# EAGLE design Grove - 2 Channel Inductive Sensor（LDC1612) (EAGLE 6.4)
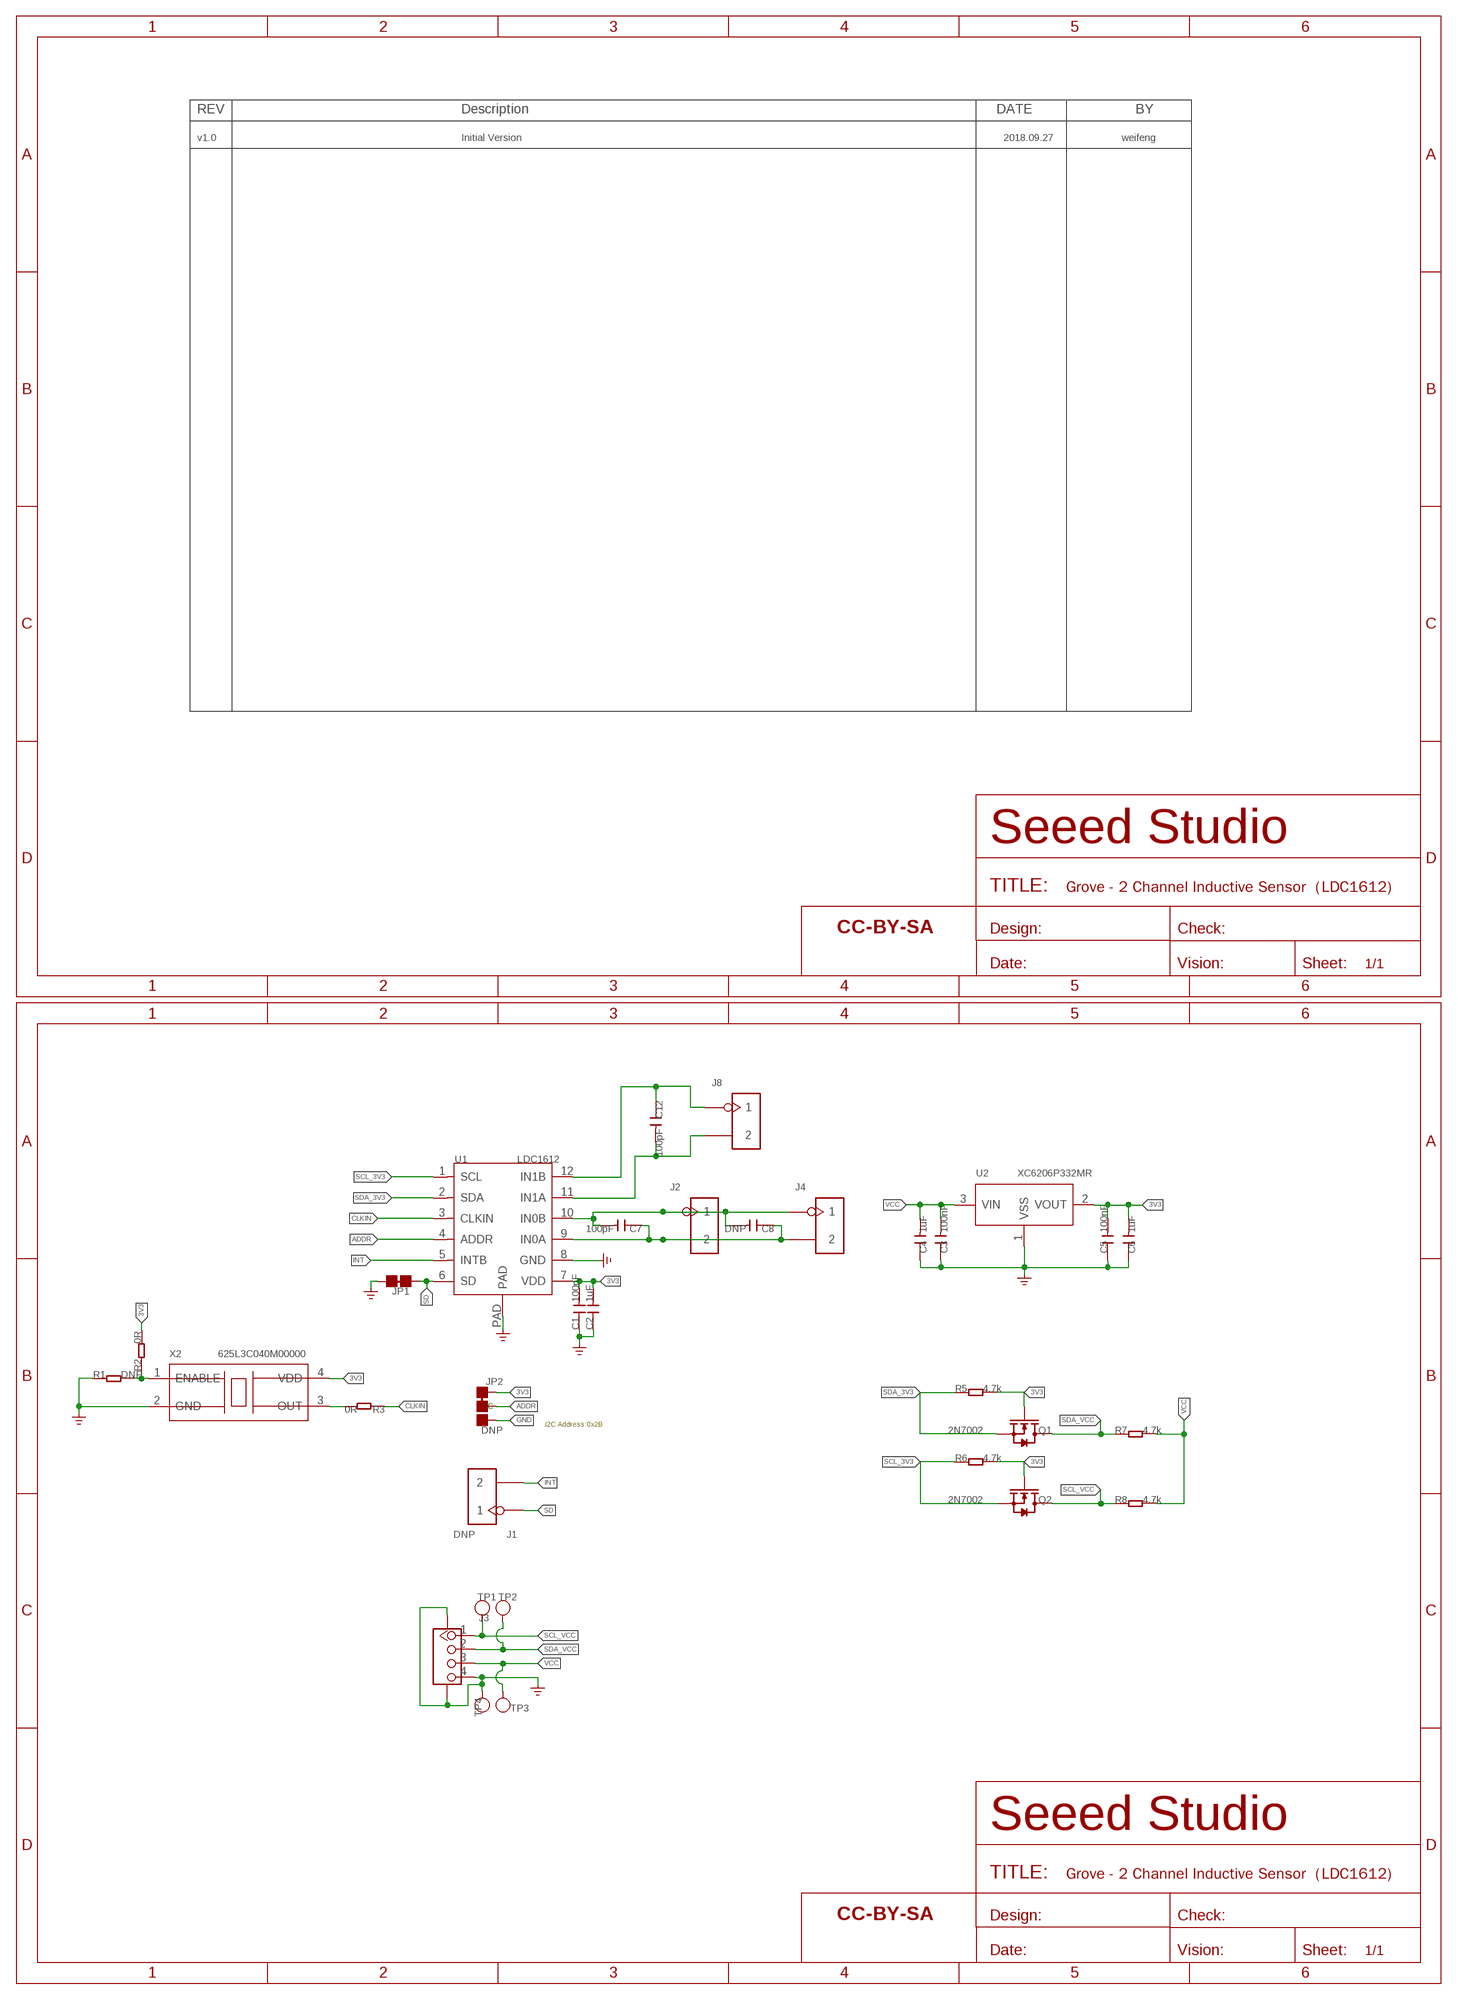
[diagram p0: schematic, sheet 1]

## Parts
C1  100nF  CAP-0603  [C0603]
C2  1uF  CAP-0603  [C0603]
C3  100nF  CAP-0603  [C0603]
C4  1uF  CAP-0603  [C0603]
C5  100nF  CAP-0603  [C0603]
C6  1uF  CAP-0603  [C0603]
C7  100pF  CAP-0603  [C0603]
C8  DNP  CAP-0603  [C0603]
C12  100pF  CAP-0603  [C0603]
FR1  SEEEDSTUDIO-OPEN-SCH-FRAME  [SEEEDSTUDIO-PCB-FRAME]
J1  DNP  HEADER-2P-65/35MIL  [H2-2.54]
J2  HEADER-2P-65/35MIL  [H2-2.54]
J3  GROVE-CONNECTOR-SMD'DD'  [HW4-SMD-2.0]
J4  HEADER-2P-65/35MIL  [H2-2.54]
J8  HEADER-2P-65/35MIL  [H2-2.54]
JP1  JP-2P-SHORT  [2P-SMD-SHORT]
JP2  DNP  JP-3P-SHORT  [3P-SMD-SHORT]
Q1  2N7002  MOSFET-N'SOT23'  [SOT-23]
Q2  2N7002  MOSFET-N'SOT23'  [SOT-23]
R1  DNP  RES-0603  [R0603]
R2  0R  RES-0603  [R0603]
R3  0R  RES-0603  [R0603]
R5  4.7k  RES-0603  [R0603]
R6  4.7k  RES-0603  [R0603]
R7  4.7k  RES-0603  [R0603]
R8  4.7k  RES-0603  [R0603]
TP1  TEST-POINT'4545'  [TP-D45MIL]
TP2  TEST-POINT'4545'  [TP-D45MIL]
TP3  TEST-POINT'4545'  [TP-D45MIL]
TP4  TEST-POINT'4545'  [TP-D45MIL]
U1  LDC1612  DRIVER-LDC1612  [DFN12G-0.5-4X4MM]
U2  XC6206P332MR  PMIC-XC6206PMR  [SOT-23]
U$4  SEEEDSTUDIO-OPEN-SCH-FRAME  [SEEEDSTUDIO-PCB-FRAME]
X2  625L3C040M00000  CRYSTAL-OSCILLATOR-2.5*2.0  [OSC4-SMD-2.5X2.0X0.8MM]

## Nets
3V3: C1.2 C2.2 C5.2 C6.2 JP2.11(L) Q1.1(G) Q2.1(G) R2.2 R5.2 R6.2 U1.7(VDD) U2.2(VOUT) X2.4(VDD)
ADDR: JP2.MM(C) U1.4(ADDR)
CLKIN: R3.1 U1.3(CLKIN)
GND: C1.1 C2.1 C3.1 C4.1 C5.1 C6.1 J3.4 J3.SS1 J3.SS2 JP1.1 JP2.00(R) R1.1 TP4.T U1.8(GND) U1.PAD U2.1(VSS) X2.2(GND) ; supply symbol labelled GND_POWER
INT: J1.2 U1.5(INTB)
N$1: R3.2 X2.3(OUT)
N$3: R1.2 R2.1 X2.1(ENABLE)
N$5: C7.1 C8.1 J2.2 J4.2 U1.9(IN0A)
N$6: C7.2 C8.2 J2.1 J4.1 U1.10(IN0B)
N$14: C12.1 J8.1 U1.12(IN1B)
N$15: C12.2 J8.2 U1.11(IN1A)
SCL_3V3: Q2.2(S) R6.1 U1.1(SCL)
SCL_VCC: J3.1 Q2.3(D) R8.1 TP1.T
SD: J1.1 JP1.2 U1.6(SD)
SDA_3V3: Q1.2(S) R5.1 U1.2(SDA)
SDA_VCC: J3.2 Q1.3(D) R7.1 TP2.T
VCC: C3.2 C4.2 J3.3 R7.2 R8.2 TP3.T U2.3(VIN)

## Notes on the sheet
- v1.0 | Initial Version | 2018.09.27 | weifeng
- I2C Address:0x2B

## Library data of the parts
C1-C8 C12 = Discrete-new:CAP: Ceramic Capacitors
FR1 U$4 = moudle-new:SEEEDSTUDIO-OPEN-SCH-FRAME
J1 J2 J4 J8 = Connector-new:HEADER-2P
J3 = Connector-new:GROVE-CONNECTOR-SMD: 4P-SMD-2.0:320110030;4P-SMD-2.0-90D:320110032
JP1 = Discrete-new:JP-2P-SHORT
JP2 = Discrete-new:JP-3P-SHORT
Q1 Q2 = Discrete-new:MOSFET-N
R1-R3 R5-R8 = Discrete-new:RES
TP1-TP4 = Discrete-new:TEST-POINT; PARTNO: DNP
U1 = IC-new:DRIVER-LDC1612
U2 = IC-new:PMIC-XC6206P: LOW ESR Cap.Compatible Positive Voltage Regulators
X2 = Discrete-new:CRYSTAL-OSCILLATOR

## Net classes
3 usbvcc: width 0.203 mm, drill 0.305 mm, clearance 0.203 mm

## Board
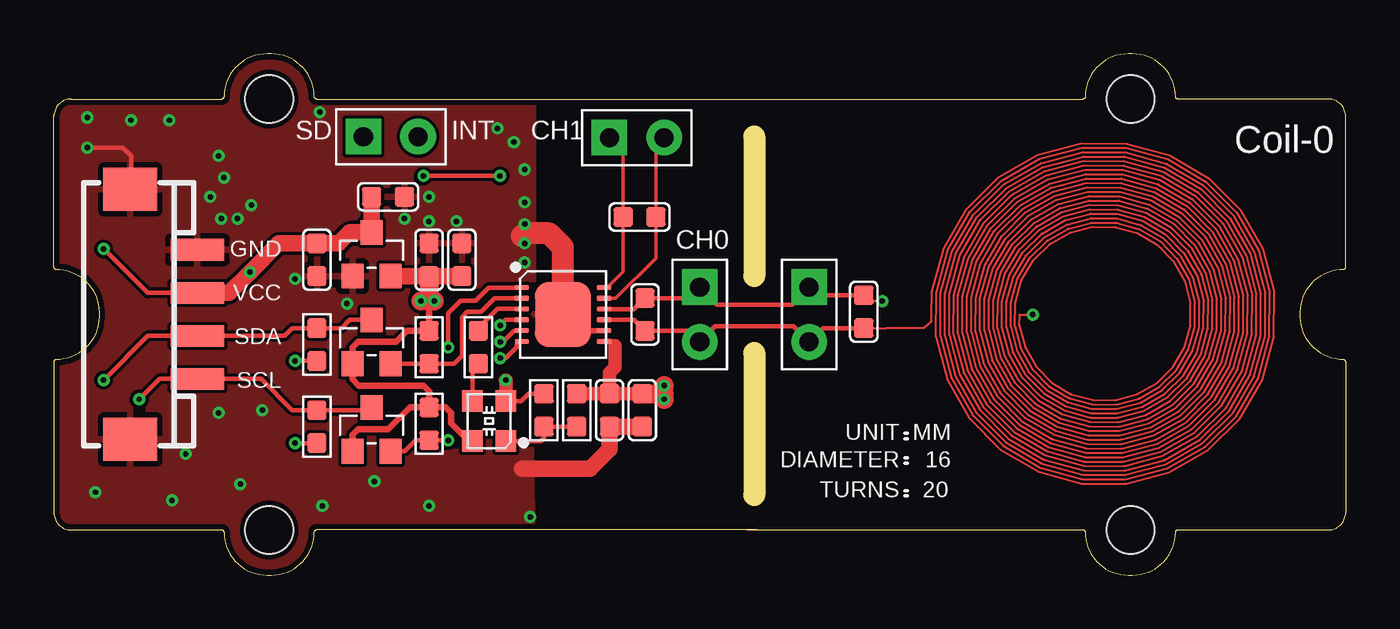
[diagram p1: board, top side]
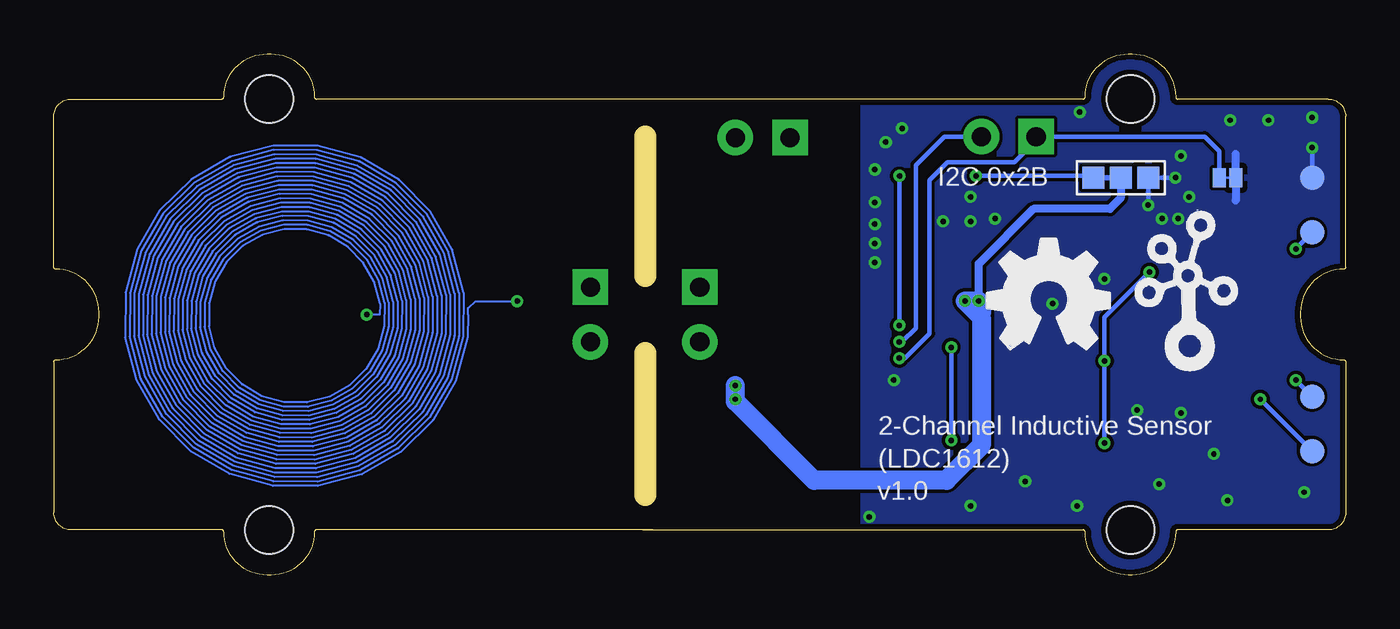
[diagram p2: board, bottom side, seen from below]

Size 60 x 24.2 mm. Coordinates in mm from the lower left corner, seen from the top.
Outline: 32.54,20.36 32.54,13.88
Outline: 32.54,10.32 32.54,3.72
Copper layers (1*16): Top 0.035mm / dielectric 1.5mm / Bottom 0.035mm
Design rules "SeeedStudio_2layer_DRU_no_angle_20140221 *": minimum track width 6mil, minimum drill 10mil, track to track 6mil, track to pad 6mil, pad to pad 6mil, via to via 6mil, smd to smd 0mil, copper to edge 10mil, drill to drill 10mil, minimum pad ring 10mil, minimum via ring 6mil, stop-mask expansion 2mil, vias tented up to drill 25mil, thermal gap 10mil
tRestrict: area 19.2,6.3 to 26.1,9.9

### Footprints (pad centres in the part's own frame; a part is rotated, then mirrored left to right if it is on the bottom)
C0603 = smd 0.889 x 0.889: 1 0,0.762; 2 0,-0.762
H2-2.54 = drill 0.889 pad 1.651 square: 1 0,1.27 | drill 0.889 pad 1.651: 2 0,-1.27
HW4-SMD-2.0 = smd 1 x 2.5: 1 -3,0; 2 -1,0; 3 1,0; 4 3,0 | smd 2 x 2.5: SS1 -5.8,3.123; SS2 5.8,3.123
2P-SMD-SHORT = smd 0.889 x 0.61: 1 0,0.381; 2 0,-0.381
3P-SMD-SHORT = smd 1.016 x 1.016: 00 -1.27,0; 11 1.27,0; MM 0,0
SOT-23 = smd 1.143 x 1.016: 1 1.016,-0.889; 2 1.016,0.889; 3 -1.016,0
R0603 = smd 0.889 x 0.889: 1 0,0.762; 2 0,-0.762
TP-D45MIL = smd 1.143 x 1.143: T 0,0
DFN12G-0.5-4X4MM = smd 0.675 x 0.25: 1 -1.913,1.25; 2 -1.913,0.75; 3 -1.913,0.25; 4 -1.913,-0.25; 5 -1.913,-0.75; 6 -1.913,-1.25; 7 1.913,-1.25; 8 1.913,-0.75; 9 1.913,-0.25; 10 1.913,0.25; 11 1.913,0.75; 12 1.913,1.25 | smd 2.6 x 3: PAD 0,0
SOT-23' = smd 1.016 x 1.143: 1 -0.889,-1.016; 2 0.889,-1.016; 3 0,1.016
GROVE-1*3-DRILL-DIM = hole 2.2: 20,10; 20,-10; -20,-10; -20,10
OSC4-SMD-2.5X2.0X0.8MM = smd 1 x 0.95: 1 -0.925,-0.775; 2 0.925,-0.775; 3 0.925,0.775; 4 -0.925,0.775

### Placement (x,y rotation side)
C1  25.81,7.66 180 top
C2  27.33,7.66 180 top
C3  12.22,14.64 180 top
C4  15.52,17.56 270 top
C5  17.43,14.64 0 top
C6  18.95,14.64 0 top
C7  27.46,12.1 180 top
C8  37.62,12.23 180 top
C12  27.2,16.63 90 top
FR1  -9.5,-15 0 top  (outside the outline)
J1  15.65,20.36 90 top
J2  30,12.1 0 top
J3  6.67,12.1 90 top
J4  35.08,12.1 0 top
J8  27.08,20.31 90 top
JP1  5.49,18.45 270 bottom
JP2  10.44,18.45 180 bottom
Q1  14.76,10.83 270 top
Q2  14.76,6.77 270 top
R1  22.76,7.66 0 top
R2  24.29,7.66 180 top
R3  19.71,10.58 0 top
R5  17.43,10.58 180 top
R6  17.43,7.02 180 top
R7  12.22,10.7 0 top
R8  12.22,6.89 0 top
TP1  1.55,5.75 0 bottom
TP2  1.55,8.29 0 bottom
TP3  1.55,15.91 0 bottom
TP4  1.55,18.45 0 bottom
U1  23.65,12.1 0 top
U2  XC6206P332MR  [SOT-23']  14.76,14.89 0 top
U$4  -8.87,-8.01 0 top  (outside the outline)
U$6  [OSHW_FILLX200_NOTEXT]  16.63,10.52 0 bottom
U$7  [TWIGLOGO]  7.3,10.44 0 bottom
U$14  [GROVE-1*3-DRILL-DIM]  30,12.1 0 top
X2  20.22,7.15 90 top

### Tracks (layer width: path | path; a pad name or v marks a point on that pad's centre or on a via)
3V3  (via drill 0.25 pad 0.51)
  Top 0.254: U1.7 25.87,10.85 26.06,10.66
  Top 0.305: R6.2 16.54,7.78 15.52,6.77 14.12,6.77 13.87,6.51 Q2.1 | R6.2 17.43,8.54 17.17,8.8 14.16,8.8 13.87,9.08 Q1.1 13.87,10.58 14.12,10.83 15.9,10.83 16.41,11.34 R5.2 17.43,12.48 v17.68,12.73 | R6.2 18.19,7.78 18.44,7.53 18.44,7.06 19.28,6.22 X2.4
  Top 0.635: 26.06,10.66 26.06,9.64 25.8,9.39 C1.2 | C1.2 27.46,8.42 | C1.2 R2.2
  Top 0.762: U2.2 C5.2 C6.2
  Top 0.889: C2.2 27.46,8.42 28.35,8.42 | 28.35,8.42 v28.35,8.8 | v28.35,8.16 28.35,8.42 | C5.2 17.43,12.73 | 17.43,12.73 v17.05,12.73 | 17.43,12.73 v17.68,12.73
  Bottom 0.381: 10.44,18.45 10.44,17.51 10.95,17.01 14.5,17.01 17.05,14.46 v17.05,12.73
  Bottom 0.889: v28.35,8.8 28.35,8.06 24.69,4.4 18.53,4.4 16.92,6.01 16.92,11.97 v17.68,12.73 v17.05,12.73 16.92,12.61 16.92,12.1
ADDR  (via drill 0.25 pad 0.51)
  Top 0.203: U1.4 20.99,11.85 v20.73,11.59 | v20.73,18.53 v17.17,18.53
  Bottom 0.203: v20.73,11.59 20.73,18.07 v20.73,18.53 | 11.71,18.45 11.76,18.4 11.89,18.53 v17.17,18.53
CLKIN
  Top 0.203: R3.1 19.84,11.46 19.84,11.59 20.6,12.35 21.61,12.35 U1.3
GND  (via drill 0.25 pad 0.51)
  Top 0.203: v1.55,19.85 3.2,19.85 3.58,19.47 3.58,17.94 J3.SS2 | X2.2 21.7,8.07 22.04,8.42 R1.1
  Top 0.254: U1.8 24.35,11.35 23.65,12.05 U1.PAD
  Top 0.635: X2.2 21,9.04 v20.98,9.05
  Top 0.762: C2.1 C1.1 25.81,5.83 24.92,4.94 21.74,4.94
  Top 1.016: U1.PAD 23.65,15.22 23.01,15.86 21.87,15.86 21.74,15.74
  Bottom 0.203: TP4.T v1.55,19.85 | v9.17,17.18 JP2.00 v7.9,18.45
  Bottom 0.381: 5.1,19.55 5.11,19.54 JP1.1 5.11,17.39 5.1,17.39
  other vias: 22.13,2.7 12.35,21.5 17.43,17.56 16.28,16.55 17.43,16.42 18.7,16.42 7.78,16.55 8.54,16.55 7.27,17.56 5.36,21.12 7.65,7.53 1.93,3.85 5.49,3.46 8.66,4.23 12.47,3.21 17.43,3.21 13.62,12.61 3.58,21.12 11.2,13.75 6.12,5.62 21.36,20.1 1.55,21.24 7.65,19.47 20.6,20.74 9.68,7.66 21.87,17.31 21.87,15.4 21.87,16.29 21.87,18.83 14.89,4.35 21.87,14.51
  pour Top: -1.5,2.45 -1.5,23.44 arc-90 -0.66,24.28 22.25,24.28 22.25,18.32 22.25,18.31 22.25,9.53 22.13,9.05 22.25,-0.6 1.17,-0.22
  pour Bottom: -1.75,2.19 -1.75,23.28 arc-90 -0.67,24.36 22.38,24.25 22.39,24.23 22.39,0.89 22.38,-0.65 12.6,-0.85 11.33,-0.85 1.17,-0.73
INT  (via drill 0.25 pad 0.51)
  Top 0.203: U1.5 21.38,11.35 20.86,10.83 v20.73,10.83
  Bottom 0.203: v20.73,10.83 20.6,10.83 19.97,11.46 19.97,19.04 18.65,20.36 J1.2
N$1
  Top 0.203: X2.3 19.45,9.67 R3.2
N$2
  Top 0.102: 38.66,11.48 40.4,11.48 40.77,11.79 40.77,12.09 40.78,13.14 41.33,15.17 42.39,16.99 43.88,18.47 45.7,19.51 47.73,20.05 49.82,20.04 51.84,19.49 53.64,18.44 55.11,16.95 56.14,15.14 56.67,13.13 56.67,11.05 56.12,9.05 55.08,7.26 53.6,5.8 51.81,4.77 49.81,4.24 47.74,4.25 45.75,4.79 43.97,5.83 42.52,7.29 41.5,9.08 40.97,11.06 40.98,13.12 41.52,15.1 42.55,16.87 44.01,18.3 45.78,19.32 47.75,19.84 49.79,19.83 51.76,19.3 53.52,18.27 54.95,16.83 55.95,15.07 56.47,13.11 56.46,11.08 55.93,9.13 54.91,7.38 53.48,5.96 51.73,4.96 49.78,4.44 47.77,4.46 45.83,4.98 44.09,5.99 42.68,7.42 41.69,9.16 41.18,11.09 41.19,13.09 41.71,15.02 42.72,16.74 44.13,18.14 45.86,19.13 47.78,19.64 49.76,19.63 51.68,19.11 53.39,18.11 54.78,16.7 55.76,14.99 56.27,13.08 56.26,11.11 55.74,9.21 54.75,7.5 53.35,6.12 51.65,5.15 49.75,4.65 47.79,4.66 45.91,5.17 44.22,6.16 42.84,7.54 41.88,9.23 41.38,11.12 41.39,13.06 41.9,14.94 42.88,16.61 44.25,17.98 45.94,18.94 47.8,19.43 49.74,19.42 51.6,18.91 53.26,17.95 54.62,16.58 55.57,14.91 56.06,13.05 56.05,11.13 55.55,9.29 54.59,7.63 53.23,6.29 51.57,5.34 49.73,4.85 47.82,4.86 45.98,5.36 44.34,6.32 43.01,7.67 42.07,9.31 41.59,11.14 41.59,13.04 42.09,14.86 43.04,16.49 44.38,17.82 46.02,18.75 47.83,19.23 49.71,19.22 51.52,18.72 53.14,17.78 54.45,16.45 55.38,14.83 55.86,13.03 55.85,11.16 55.36,9.36 54.42,7.76 53.1,6.45 51.49,5.53 49.7,5.06 47.85,5.07 46.06,5.55 44.47,6.48 43.17,7.79 42.26,9.39 41.79,11.17 41.8,13.01 42.28,14.78 43.2,16.37 44.51,17.65 46.09,18.56 47.86,19.02 49.69,19.01 51.44,18.53 53.01,17.62 54.29,16.33 55.19,14.75 55.65,13 55.64,11.19 55.17,9.44 54.26,7.88 52.98,6.61 51.41,5.72 49.67,5.26 47.87,5.27 46.14,5.74 44.59,6.65 43.34,7.92 42.45,9.47 41.99,11.2 42,12.98 42.47,14.7 43.37,16.24 44.63,17.49 46.17,18.37 47.89,18.82 49.66,18.81 51.36,18.35 52.89,17.45 54.13,16.2 55,14.67 55.45,12.97 55.44,11.21 54.98,9.52 54.09,8.01 52.85,6.78 51.33,5.91 49.64,5.47 47.9,5.48 46.22,5.93 44.72,6.81 43.5,8.04 42.64,9.55 42.2,11.23 42.21,12.96 42.66,14.62 43.53,16.11 44.76,17.32 46.25,18.18 47.91,18.62 49.63,18.61 51.28,18.16 52.76,17.29 53.97,16.07 54.81,14.59 55.25,12.94 55.24,11.24 54.79,9.6 53.93,8.13 52.73,6.94 51.26,6.1 49.62,5.67 47.93,5.68 46.3,6.12 44.85,6.97 43.66,8.17 42.83,9.63 42.4,11.25 42.41,12.93 42.85,14.54 43.7,15.99 44.88,17.16 46.33,17.99 47.94,18.41 49.6,18.4 51.2,17.96 52.64,17.13 53.8,15.95 54.62,14.51 55.04,12.92 55.03,11.27 54.6,9.68 53.77,8.26 52.6,7.1 51.18,6.29 49.59,5.87 47.95,5.88 46.38,6.31 44.97,7.14 43.83,8.29 43.02,9.71 42.61,11.28 42.62,12.9 43.04,14.46 43.86,15.86 45.01,17 46.41,17.8 47.97,18.21 49.58,18.2 51.12,17.77 52.51,16.96 53.64,15.83 54.43,14.43 54.84,12.89 54.83,11.29 54.41,9.76 53.6,8.38 52.47,7.27 51.1,6.48 49.56,6.08 47.98,6.09 46.46,6.5 45.09,7.3 43.99,8.42 43.21,9.79 42.81,11.31 42.82,12.88 43.23,14.39 44.02,15.74 45.13,16.84 46.49,17.61 47.99,18 49.55,17.99 51.05,17.58 52.39,16.8 53.48,15.7 54.24,14.36 54.63,12.86 54.62,11.32 54.22,9.84 53.44,8.51 52.35,7.43 51.02,6.67 49.54,6.28 48.01,6.29 46.54,6.7 45.22,7.46 44.15,8.55 43.4,9.87 43.02,11.33 43.02,12.85 43.42,14.31 44.19,15.61 45.26,16.67 46.57,17.42 48.02,17.8 49.52,17.79 50.97,17.39 52.26,16.64 53.31,15.57 54.05,14.28 54.43,12.84 54.42,11.35 54.03,9.92 53.28,8.63 52.23,7.59 50.94,6.86 49.51,6.49 48.04,6.5 46.62,6.89 45.35,7.63 44.31,8.67 43.59,9.94 43.22,11.36 43.23,12.82 43.61,14.23 44.35,15.49 45.39,16.51 46.65,17.23 48.05,17.59 49.5,17.59 50.89,17.2 52.14,16.47 53.15,15.45 53.86,14.2 54.22,12.81 54.22,11.38 53.84,9.99 53.11,8.76 52.1,7.76 50.86,7.05 49.48,6.69 48.06,6.7 46.7,7.08 45.47,7.79 44.48,8.79 43.78,10.03 43.42,11.39 43.43,12.79 43.8,14.15 44.51,15.36 45.51,16.34 46.72,17.04 48.08,17.39 49.47,17.38 50.81,17.01 52.01,16.31 52.98,15.32 53.67,14.12 54.02,12.78 54.01,11.4 53.65,10.07 52.95,8.88 51.97,7.92 50.78,7.24 49.46,6.9 48.09,6.9 46.77,7.27 45.6,7.96 44.64,8.92 43.97,10.1 43.63,11.41 43.64,12.77 44,14.07 44.68,15.23 45.63,16.18 46.8,16.85 48.1,17.19 49.44,17.18 50.73,16.82 51.89,16.15 52.82,15.2 53.48,14.04 53.81,12.76 53.81,11.43 53.46,10.15 52.79,9.01 51.85,8.08 50.7,7.43 49.43,7.1 48.12,7.11 46.85,7.46 45.72,8.12 44.81,9.05 44.16,10.18 43.83,11.44 43.84,12.74 44.18,13.99 44.84,15.11 45.76,16.02 46.88,16.66 48.13,16.98 49.42,16.97 50.65,16.63 51.76,15.98 52.66,15.07 53.29,13.96 53.61,12.73 53.6,11.46 53.27,10.23 52.62,9.14 51.72,8.25 50.62,7.62 49.4,7.3 48.14,7.31 46.93,7.65 45.85,8.28 44.97,9.17 44.35,10.26 44.04,11.47 44.04,12.71 44.37,13.91 45,14.98 45.89,15.85 46.96,16.47 48.16,16.78 49.39,16.77 50.57,16.44 51.63,15.82 52.49,14.95 53.1,13.88 53.41,12.7 53.4,11.48 53.08,10.31 52.46,9.26 51.6,8.41 50.55,7.81 49.38,7.51 48.17,7.52 47.01,7.83 45.97,8.45 45.13,9.3 44.54,10.34 44.24,11.5 44.25,12.69 44.56,13.84 45.17,14.86 46.01,15.69 47.04,16.28 48.18,16.57 49.36,16.57 50.5,16.25 51.51,15.66 52.33,14.82 52.91,13.8 53.2,12.67 53.2,11.51 52.89,10.39 52.3,9.39 51.47,8.57 50.47,8 49.35,7.71 48.2,7.72 47.09,8.03 46.1,8.61 45.3,9.42 44.73,10.42 44.45,11.52 44.45,12.66 44.76,13.76 45.33,14.73 46.14,15.53 47.12,16.09 48.21,16.37 49.33,16.36 50.42,16.06 51.38,15.49 52.17,14.7 52.72,13.73 53,12.65 52.99,11.54 52.7,10.47 52.13,9.51 51.35,8.74 50.39,8.19 49.32,7.92 48.22,7.92 47.17,8.22 46.23,8.77 45.46,9.55 44.92,10.5 44.65,11.55 44.66,12.63 44.95,13.68 45.49,14.61 46.26,15.36 47.2,15.89 48.24,16.16 49.31,16.16 50.34,15.87 51.26,15.33 52,14.57 52.53,13.65 52.79,12.62 52.79,11.56 52.5,10.55 51.97,9.64 51.22,8.9 50.31,8.38 49.3,8.12 48.25,8.13 47.25,8.41 46.35,8.94 45.62,9.67 45.11,10.58 44.85,11.58 44.86,12.09 45.47,12.09
N$3
  Top 0.203: R2.1 R1.2 22.76,6.39 22.6,6.22 X2.1
N$5
  Top 0.102: C8.1 38.07,11.46 38.07,11.47 38.65,11.47 38.66,11.48
  Top 0.203: C8.1 35.72,11.46 J4.2 34.36,11.55 30.72,11.55 J2.2 29.49,11.34 C7.1 26.95,11.85 U1.9
N$6
  Top 0.203: C8.2 35.46,12.99 J4.1 34.27,12.56 30.81,12.56 J2.1 29.49,12.86 C7.2 26.95,12.35 U1.10
N$7  (via drill 0.25 pad 0.51)
  Top 0.102: v45.47,12.09 v45.47,12.1 | v38.48,12.71 37.95,12.71 37.69,12.97
  Bottom 0.102: v45.47,12.09 44.86,12.09 44.85,12.61 45.11,13.61 45.62,14.51 46.35,15.25 47.25,15.78 48.25,16.05 49.3,16.06 50.31,15.8 51.22,15.28 51.97,14.55 52.5,13.64 52.79,12.62 52.79,11.56 52.53,10.54 52,9.61 51.26,8.85 50.34,8.31 49.31,8.03 48.24,8.02 47.2,8.29 46.26,8.82 45.49,9.57 44.95,10.51 44.66,11.55 44.65,12.63 44.92,13.69 45.46,14.63 46.23,15.41 47.17,15.97 48.22,16.26 49.32,16.27 50.39,15.99 51.35,15.45 52.13,14.67 52.7,13.71 52.99,12.65 53,11.54 52.72,10.46 52.17,9.49 51.38,8.69 50.42,8.12 49.33,7.82 48.21,7.82 47.12,8.1 46.14,8.66 45.33,9.45 44.76,10.43 44.45,11.52 44.45,12.66 44.73,13.77 45.3,14.76 46.1,15.57 47.09,16.16 48.2,16.46 49.35,16.47 50.47,16.18 51.47,15.61 52.3,14.79 52.89,13.79 53.2,12.67 53.2,11.51 52.91,10.38 52.33,9.36 51.51,8.53 50.5,7.93 49.36,7.62 48.18,7.61 47.04,7.91 46.01,8.49 45.17,9.32 44.56,10.35 44.25,11.5 44.24,12.69 44.54,13.85 45.13,14.88 45.97,15.74 47.01,16.35 48.17,16.67 49.38,16.68 50.55,16.37 51.6,15.77 52.46,14.92 53.08,13.87 53.4,12.7 53.41,11.48 53.1,10.3 52.49,9.23 51.63,8.36 50.57,7.74 49.39,7.41 48.16,7.41 46.96,7.72 45.89,8.33 45,9.2 44.37,10.27 44.04,11.47 44.04,12.71 44.35,13.92 44.97,15.01 45.85,15.9 46.93,16.54 48.14,16.87 49.4,16.88 50.62,16.56 51.72,15.94 52.62,15.05 53.27,13.95 53.6,12.73 53.61,11.46 53.29,10.22 52.66,9.11 51.76,8.2 50.65,7.55 49.42,7.21 48.13,7.2 46.88,7.53 45.76,8.17 44.84,9.07 44.18,10.19 43.84,11.44 43.83,12.74 44.16,14 44.81,15.13 45.72,16.07 46.85,16.73 48.12,17.08 49.43,17.08 50.7,16.75 51.85,16.1 52.79,15.17 53.46,14.03 53.81,12.76 53.81,11.43 53.48,10.14 52.82,8.99 51.89,8.04 50.73,7.36 49.44,7.01 48.1,7 46.8,7.34 45.63,8 44.68,8.95 44,10.11 43.64,11.41 43.63,12.77 43.97,14.08 44.64,15.26 45.6,16.23 46.77,16.92 48.09,17.28 49.46,17.29 50.78,16.94 51.97,16.26 52.95,15.3 53.65,14.11 54.01,12.78 54.02,11.4 53.67,10.06 52.98,8.86 52.01,7.87 50.81,7.17 49.47,6.8 48.08,6.79 46.72,7.15 45.51,7.84 44.51,8.82 43.8,10.03 43.43,11.39 43.42,12.8 43.78,14.16 44.48,15.39 45.47,16.39 46.7,17.11 48.06,17.48 49.48,17.49 50.86,17.13 52.1,16.43 53.11,15.42 53.84,14.19 54.22,12.81 54.22,11.37 53.86,9.98 53.15,8.73 52.14,7.71 50.89,6.98 49.5,6.6 48.05,6.59 46.65,6.96 45.39,7.68 44.35,8.7 43.61,9.95 43.23,11.36 43.22,12.82 43.59,14.24 44.31,15.51 45.35,16.55 46.62,17.3 48.04,17.69 49.51,17.7 50.94,17.32 52.23,16.59 53.28,15.55 54.03,14.27 54.42,12.83 54.43,11.35 54.05,9.91 53.31,8.61 52.26,7.55 50.97,6.79 49.52,6.39 48.02,6.39 46.57,6.77 45.26,7.51 44.19,8.57 43.42,9.88 43.02,11.34 43.02,12.85 43.4,14.32 44.15,15.64 45.22,16.72 46.54,17.49 48.01,17.89 49.54,17.9 51.02,17.51 52.35,16.75 53.44,15.67 54.22,14.35 54.62,12.86 54.63,11.32 54.24,9.83 53.48,8.48 52.39,7.38 51.05,6.6 49.55,6.19 47.99,6.18 46.49,6.58 45.13,7.35 44.02,8.45 43.23,9.8 42.82,11.31 42.81,12.88 43.21,14.4 43.99,15.76 45.09,16.88 46.46,17.68 47.98,18.1 49.56,18.11 51.1,17.7 52.47,16.92 53.6,15.8 54.41,14.43 54.83,12.89 54.84,11.29 54.43,9.75 53.64,8.36 52.51,7.22 51.12,6.41 49.58,5.99 47.97,5.98 46.41,6.39 45.01,7.19 43.86,8.32 43.04,9.72 42.62,11.28 42.61,12.9 43.02,14.47 43.83,15.89 44.97,17.05 46.38,17.87 47.95,18.3 49.59,18.31 51.18,17.89 52.6,17.08 53.77,15.93 54.6,14.51 55.03,12.92 55.04,11.27 54.62,9.67 53.8,8.23 52.64,7.06 51.2,6.22 49.6,5.78 47.94,5.77 46.33,6.2 44.88,7.02 43.7,8.2 42.85,9.64 42.41,11.25 42.4,12.93 42.83,14.55 43.66,16.01 44.85,17.21 46.3,18.06 47.93,18.5 49.62,18.51 51.26,18.08 52.73,17.24 53.93,16.05 54.79,14.58 55.24,12.94 55.25,11.24 54.81,9.59 53.97,8.11 52.76,6.89 51.28,6.03 49.63,5.58 47.91,5.57 46.25,6 44.76,6.86 43.53,8.07 42.66,9.56 42.21,11.23 42.2,12.96 42.64,14.63 43.5,16.14 44.72,17.37 46.22,18.25 47.9,18.71 49.64,18.72 51.33,18.27 52.85,17.41 54.09,16.17 54.98,14.66 55.44,12.97 55.45,11.21 55,9.51 54.13,7.98 52.89,6.73 51.36,5.84 49.66,5.37 47.89,5.36 46.17,5.81 44.63,6.7 43.37,7.95 42.47,9.48 42,11.2 41.99,12.98 42.45,14.71 43.34,16.26 44.59,17.54 46.14,18.44 47.87,18.91 49.67,18.92 51.41,18.46 52.98,17.57 54.26,16.3 55.17,14.74 55.64,13 55.65,11.19 55.19,9.43 54.29,7.86 53.01,6.57 51.44,5.65 49.69,5.17 47.86,5.16 46.09,5.62 44.51,6.53 43.2,7.82 42.28,9.4 41.8,11.17 41.79,13.01 42.26,14.79 43.17,16.39 44.47,17.7 46.06,18.63 47.85,19.12 49.7,19.13 51.49,18.65 53.1,17.73 54.42,16.43 55.36,14.82 55.85,13.02 55.86,11.16 55.38,9.35 54.45,7.73 53.14,6.4 51.52,5.46 49.71,4.96 47.83,4.96 46.02,5.44 44.38,6.37 43.04,7.69 42.09,9.32 41.59,11.15 41.59,13.04 42.07,14.87 43.01,16.52 44.34,17.86 45.98,18.82 47.82,19.32 49.73,19.33 51.57,18.84 53.23,17.9 54.59,16.55 55.55,14.9 56.05,13.05 56.06,11.13 55.57,9.28 54.62,7.61 53.26,6.24 51.6,5.27 49.74,4.76 47.8,4.75 45.94,5.25 44.25,6.21 42.88,7.57 41.9,9.25 41.39,11.12 41.38,13.06 41.88,14.95 42.84,16.64 44.22,18.03 45.91,19.01 47.79,19.52 49.75,19.54 51.65,19.03 53.35,18.06 54.75,16.68 55.74,14.98 56.26,13.08 56.27,11.1 55.76,9.2 54.78,7.48 53.39,6.08 51.68,5.08 49.76,4.56 47.78,4.55 45.86,5.05 44.13,6.04 42.72,7.44 41.71,9.17 41.19,11.09 41.18,13.09 41.69,15.03 42.68,16.77 44.09,18.19 45.83,19.2 47.77,19.73 49.78,19.74 51.73,19.23 53.48,18.22 54.91,16.8 55.93,15.06 56.46,13.1 56.47,11.08 55.95,9.12 54.95,7.36 53.52,5.91 51.76,4.89 49.79,4.35 47.75,4.34 45.78,4.86 44.01,5.88 42.55,7.32 41.52,9.09 40.98,11.07 40.97,13.12 41.5,15.11 42.52,16.89 43.97,18.35 45.75,19.39 47.74,19.93 49.81,19.94 51.81,19.41 53.6,18.39 55.08,16.93 56.12,15.13 56.67,13.13 56.67,11.05 56.14,9.04 55.11,7.23 53.64,5.75 51.84,4.7 49.82,4.15 47.73,4.14 45.7,4.67 43.88,5.71 42.39,7.19 41.33,9.01 40.78,11.04 40.77,12.09 40.77,12.4 40.4,12.71 38.49,12.71 v38.48,12.71
N$14
  Top 0.152: U1.12 25.7,13.35 26.44,14.09 C12.1 26.44,19.55 J8.1
N$15
  Top 0.152: U1.11 26.09,12.85 27.96,14.72 C12.2 27.96,19.8 J8.2
SCL_3V3  (via drill 0.25 pad 0.51)
  Top 0.203: U1.1 20.2,13.35 19.59,12.73 18.88,12.73 18.32,12.17 v18.32,10.58 | v18.32,6.26 R6.1 16.79,6.26 16.28,5.75 Q2.2
  Bottom 0.203: v18.32,10.58 v18.32,6.26
SCL_VCC  (via drill 0.25 pad 0.51)
  Top 0.203: Q2.3 14.63,7.66 R8.1 11.08,7.66 9.63,9.1 J3.1 4.91,9.1 v3.96,8.16
  Bottom 0.203: TP1.T v3.96,8.16
SD  (via drill 0.25 pad 0.51)
  Top 0.203: U1.6 21.64,10.85 21.49,10.7 21.49,10.58 20.98,10.07 v20.73,10.07
  Bottom 0.152: JP1.2 5.87,18.41 5.87,18.4
  Bottom 0.203: v20.73,10.07 20.48,10.07 19.33,11.21 19.33,18.32 18.49,19.17 15.39,19.17 14.38,20.18 J1.1 6.55,20.36 5.87,19.67 5.87,18.4
SDA_3V3
  Top 0.203: Q1.2 R5.1 18.59,9.81 18.95,10.17 18.95,11.97 19.21,12.23 19.84,12.23 20.46,12.85 U1.2
SDA_VCC  (via drill 0.25 pad 0.51)
  Top 0.203: Q1.3 13.74,11.85 13.36,11.46 R7.1 11.08,11.46 10.72,11.1 J3.2 4.37,11.1 v2.31,9.05
  Bottom 0.203: v2.31,9.05 TP2.T
VCC  (via drill 0.25 pad 0.51)
  Top 0.203: R7.2 v11.2,9.94 | v11.2,6.13 R8.2 | J3.3 4.36,13.1 v2.31,15.15
  Top 0.762: J3.3 8.14,13.1 v9.11,14.07 10.44,15.4 C3.2 13.24,15.4 13.74,15.91 U2.3 C4.2
  Bottom 0.203: v11.2,6.13 v11.2,9.94 11.2,11.97 v9.11,14.07 | v2.31,15.15 TP3.T

### Text on the board
tPlace: Coil-0 | SD | INT | CH1 | GND | CH0 | VCC | SDA | SCL | UNIT | MM | DIAMETER | 16 | TURNS | 20
bPlace: I2C 0x2B | 2-Channel Inductive Sensor | (LDC1612) | v1.0